# EAGLE schematic nRF24 Raspberry Pi adapter (EAGLE 6.6.0)
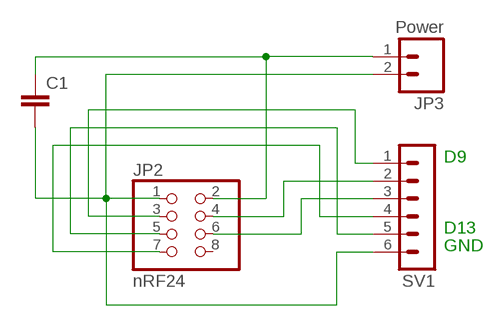
[diagram p0: schematic, sheet 1]

## Parts
C1  C2,5-3  [C2.5-3]
JP2  nRF24  PINHD-2X4  [2X04]
JP3  Power  M02LOCK_LONGPADS  [1X02_LOCK_LONGPADS]
SV1  MA06-1  [MA06-1]

## Nets
N$1: C1.2 JP2.1 JP3.2 SV1.6
N$2: JP2.3 SV1.1
N$3: C1.1 JP2.2 JP3.1
N$4: JP2.4 SV1.2
N$5: JP2.6 SV1.3
N$6: JP2.5 SV1.5
N$8: JP2.7 SV1.4
Unconnected: JP2.8

## Notes on the sheet
- D9
- D13
- GND

## Library data of the parts
C1 = capacitor-wima:C: CAPACITOR naming: grid - package width
JP2 = pinhead:PINHD-2X4: PIN HEADER
JP3 = SparkFun-Connectors:M02: Standard 2-pin 0.1" header. Use with - straight break away headers ( PRT-00116) - right angle break away headers (PRT-00553) - swiss pins (PRT-00743) - machine pins (PRT-00117) - female headers (PRT-00115) Molex polarized connector foot print use with: PRT-08233 with associated crimp pins and housings. 2.54_SCREWTERM for use with PRT-10571. 3.5mm Screw Terminal footprints for PRT-08084 5mm Screw Terminal footprints for use with PRT-08433
SV1 = con-lstb:MA06-1: PIN HEADER; OC_FARNELL: unknown; OC_NEWARK: unknown